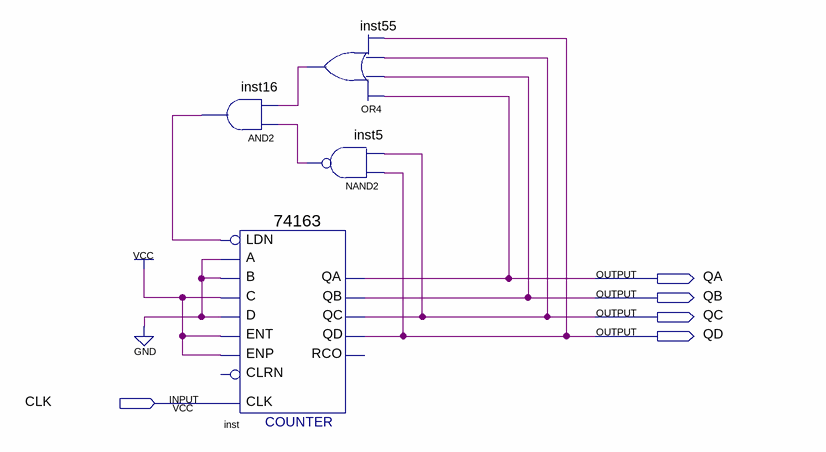
[diagram p0: schematic sheet]
// Quartus schematic SpecialCount4_12.bdf as structural Verilog: 4 symbols, 5 pins
module SpecialCount4_12 (
  input  CLK,
  output QA,
  output QB,
  output QC,
  output QD
);

  wire inst5_out, inst16_out, inst55_out;

  and inst16 (inst16_out, inst5_out, inst55_out);
  \74163  inst (
    .C(1'b1), .B(1'b0), .A(1'b0), .ENT(1'b1), .D(1'b0), .CLK(CLK), .ENP(1'b1), .LDN(inst16_out), .QA(QA),
    .QB(QB), .QC(QC), .QD(QD));  // open: CLRN, RCO
  or inst55 (inst55_out, QA, QB, QC, QD);
  nand inst5 (inst5_out, QD, QC);
endmodule
